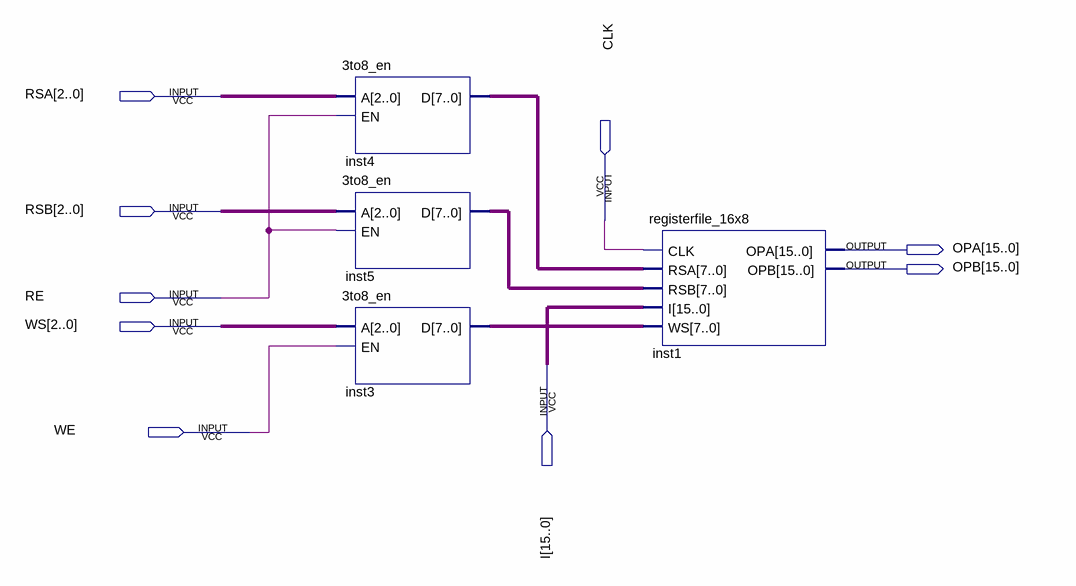
[diagram p0: schematic sheet]
// Quartus schematic register_file_16bx8_final.bdf as structural Verilog: 4 symbols, 9 pins
module register_file_16bx8_final (
  input  [2:0] RSA,
  input  [2:0] RSB,
  input  CLK,
  input  RE,
  input  [2:0] WS,
  input  [15:0] I,
  input  WE,
  output [15:0] OPA,
  output [15:0] OPB
);

  wire [7:0] inst3_d, inst4_d, inst5_d;

  \3to8_en  inst4 (.A(RSA), .EN(RE), .D(inst4_d));
  \3to8_en  inst5 (.A(RSB), .EN(RE), .D(inst5_d));
  \3to8_en  inst3 (.A(WS), .EN(WE), .D(inst3_d));
  registerfile_16x8 inst1 (.CLK(CLK), .RSA(inst4_d), .RSB(inst5_d), .I(I), .WS(inst3_d), .OPA(OPA), .OPB(OPB));
endmodule
